# Altium schematic sheet 24C04_QSPI_LCD_BEEP_CURRTEST.SchDoc
size A4
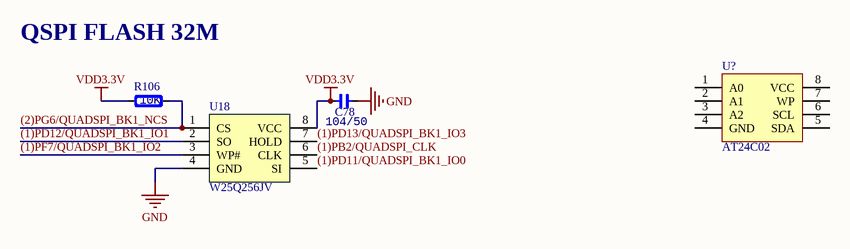
[diagram p0: 24C04_QSPI_LCD_BEEP_CURRTEST.SchDoc]

## Parts
C78  value 104/50  [CAP_0603]  (hidden comment: C0603)
R106  value 10K  [RES_0603]  (hidden comment: R0603)
U18  W25Q256JV  [SOIC8]
U?  AT24C02  [SOP8]

## Nets
GND: C78.1 U18.4(GND)
VDD3.3V: C78.2 R106.2 U18.8(VCC)
(1)PB2/QUADSPI_CLK: U18.6(CLK)
(1)PD11/QUADSPI_BK1_IO0: U18.5(SI)
(1)PD12/QUADSPI_BK1_IO1: U18.2(SO)
(1)PD13/QUADSPI_BK1_IO3: U18.7(HOLD)
(1)PF7/QUADSPI_BK1_IO2: U18.3(WP#)
(2)PG6/QUADSPI_BK1_NCS: R106.1 U18.1(CS)

Not connected (* = marked no-connect by the designer): U? 1(A0) 2(A1) 3(A2) 4(GND) 5(SDA) 6(SCL) 7(WP) 8(VCC)

## Notes on the sheet
- QSPI FLASH 32M
- UniverGao
- /

## Library data of the parts
C78 = Cap_0603: Capacitor; Specification: X7R, ±10%, 16V; Note: ±10%; Type: 0603; Manufacturer: *
R106 = Res_0603: Resistor; Specification: ±1%; Manufacturer: *; Note: ±1%; Type: 0603
U18 = W25Q128